# EAGLE design OptocouplerTest (EAGLE 9.6.2)
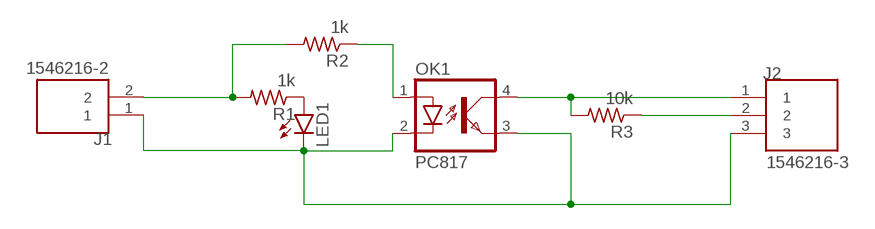
[diagram p0: schematic, sheet 1]

## Parts
J1  1546216-2  [TE_1546216-2]
J2  1546216-3  [TE_1546216-3]
LED1  LED3MM  [LED3MM]
OK1  PC817  [DIL04]
R1  1k  R-US_0207/15  [0207/15]
R2  1k  R-US_0207/15  [0207/15]
R3  10k  R-US_0207/15  [0207/15]

## Nets
N$1: LED1.A R1.1
N$2: J1.2 R1.2 R2.2
N$3: OK1.1(A) R2.1
N$4: J1.1 J2.3 LED1.K(C) OK1.2(C) OK1.3(EMIT)
N$5: J2.2 R3.1
N$6: J2.1 OK1.4(COL) R3.2

## Library data of the parts
J1 = terminal-block-2p:1546216-2: Check availability <https://pricing.snapeda.com/parts/1546216-2/TE%20Connectivity/view-part?ref=eda>; AVAILABILITY: In Stock; CENTERLINE_PITCH: 5 mm[.197 in]; COMMENT: 1546216-2; DESCRIPTION: TERMI-BLOK PCB MOUNT 90 2P.; EU_ROHS_COMPLIANCE: Compliant with Exemptions; MF: TE Connectivity; MP: 1546216-2; NUMBER_OF_POSITIONS: 2; PACKAGE: None; PRICE: None; PURCHASE-URL: https://pricing.snapeda.com/search/part/1546216-2/?ref=eda
J2 = terminal-block-3p:1546216-3: Check availability <https://pricing.snapeda.com/parts/1546216-3/TE%20Connectivity/view-part?ref=eda>; AVAILABILITY: In Stock; COMMENT: 1546216-3; DESCRIPTION: 3 Position Wire to Board Terminal Block Horizontal with Board 0.197 (5.00mm) Through Hole; MF: TE Connectivity; MP: 1546216-3; PACKAGE: None; PRICE: None; PURCHASE-URL: https://pricing.snapeda.com/search/part/1546216-3/?ref=eda
LED1 = led:LED: LED OSRAM: - CHIPLED LG R971, LG N971, LY N971, LG Q971, LY Q971, LO R971, LY R971 LH N974, LH R974 LS Q976, LO Q976, LY Q976 LO Q996 - Hyper CHIPLED LW Q18S LB Q993, LB Q99A, LB R99A - SideLED LS A670, LO A670, LY A670, LG A670, LP A670 LB A673, LV A673, LT A673, LW A673 LH A674 LY A675 LS A676, LA A676, LO A676, LY A676, LW A676 LS A679, LY A679, LG A679 - Hyper Micro SIDELED® LS Y876, LA Y876, LO Y876, LY Y876 LT Y87S - SmartLED LW L88C, LW L88S LB L89C, LB L89S, LG L890 LS L89K, LO L89K, LY L89K LS L896, LA L896, LO L896, LY L896 - TOPLED LS T670, LO T670, LY T670, LG T670, LP T670 LSG T670, LSP T670, LSY T670, LOP T670, LYG T670 LG T671, LOG T671, LSG T671 LB T673, LV T673, LT T673, LW T673 LH T674 LS T676, LA T676, LO T676, LY T676, LB T676, LH T676, LSB T676, LW T676 LB T67C, LV T67C, LT T67C, LS T67K, LO T67K, LY T67K, LW E67C LS E67B, LA E67B, LO E67B, LY E67B, LB E67C, LV E67C, LT E67C LW T67C LS T679, LY T679, LG T679 LS T770, LO T770, LY T770, LG T770, LP T770 LB T773, LV T773, LT T773, LW T773 LH T774 LS E675, LA E675, LY E675, LS T675 LS T776, LA T776, LO T776, LY T776, LB T776 LHGB T686 LT T68C, LB T68C - Hyper Mini TOPLED® LB M676 - Mini TOPLED Santana® LG M470 LS M47K, LO M47K, LY M47K Source: http://www.osram.convergy.de LUXEON: - LUMILED® LXK2-PW12-R00, LXK2-PW12-S00, LXK2-PW14-U00, LXK2-PW14-V00 LXK2-PM12-R00, LXK2-PM12-S00, LXK2-PM14-U00 LXK2-PE12-Q00, LXK2-PE12-R00, LXK2-PE12-S00, LXK2-PE14-T00, LXK2-PE14-U00 LXK2-PB12-K00, LXK2-PB12-L00, LXK2-PB12-M00, LXK2-PB14-N00, LXK2-PB14-P00, LXK2-PB14-Q00 LXK2-PR12-L00, LXK2-PR12-M00, LXK2-PR14-Q00, LXK2-PR14-R00 LXK2-PD12-Q00, LXK2-PD12-R00, LXK2-PD12-S00 LXK2-PH12-R00, LXK2-PH12-S00 LXK2-PL12-P00, LXK2-PL12-Q00, LXK2-PL12-R00 Source: www.luxeon.com KINGBRIGHT: KA-3528ASYC Source: www.kingbright.com
OK1 = optocoupler:PC817: SHARP OPTO COUPLER; MPN: PC817X4J000F; OC_FARNELL: 9707727; OC_NEWARK: 97K7059
R1-R3 = rcl:R-US_: RESISTOR, American symbol; SPICEPREFIX: R

## Board
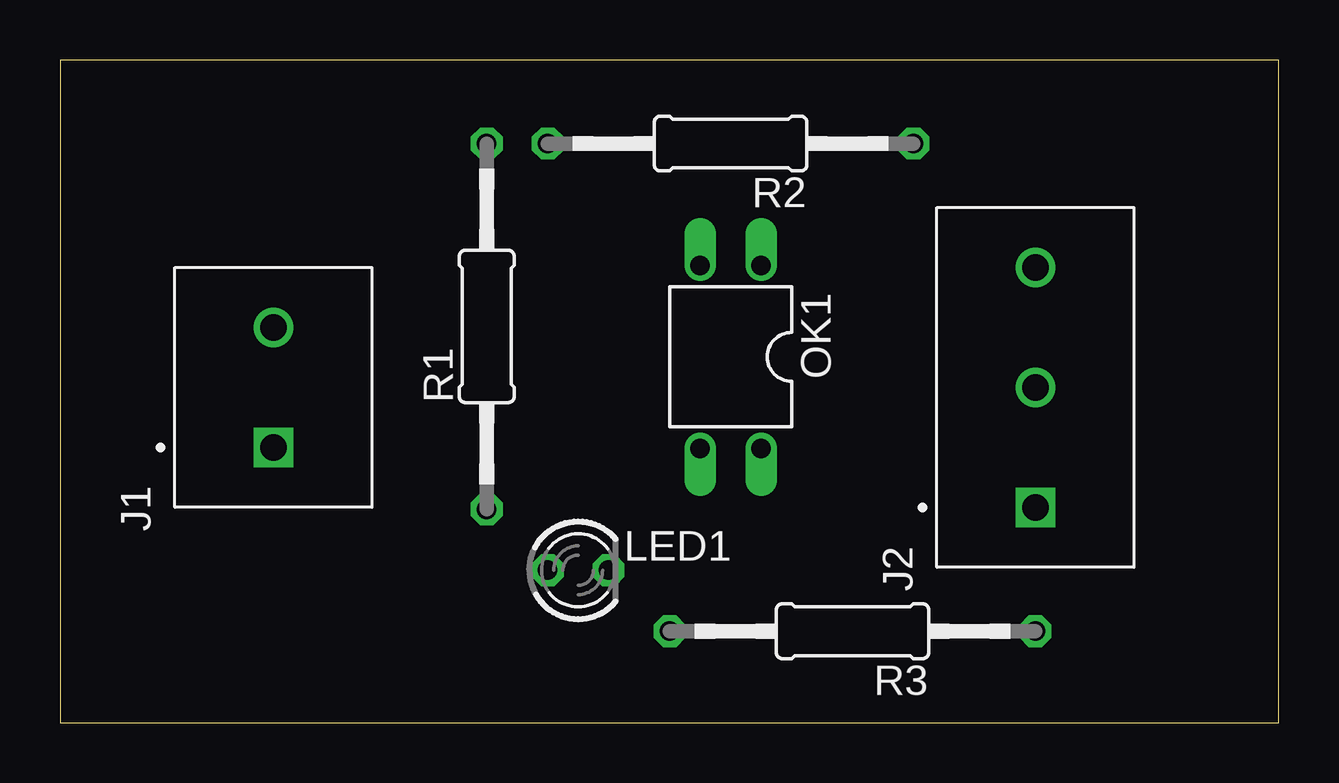
[diagram p1: board, top side]
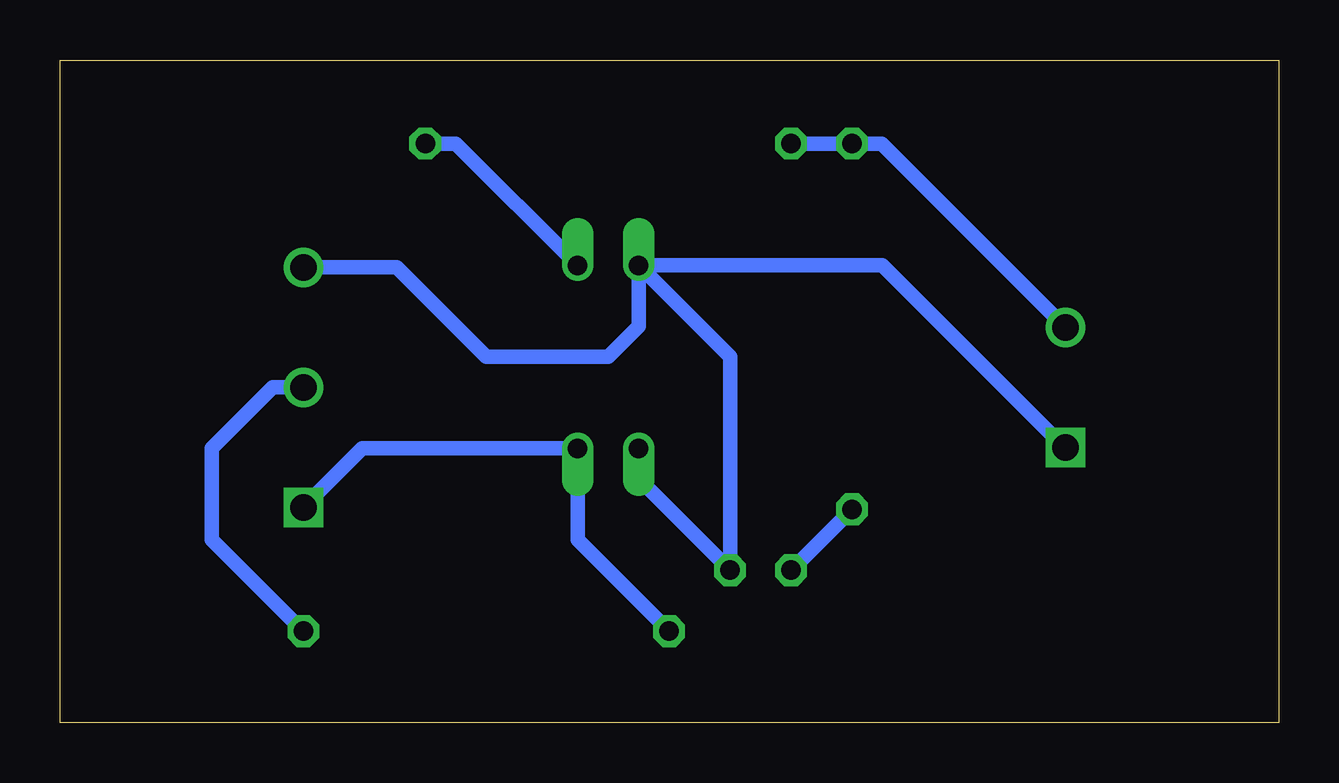
[diagram p2: board, bottom side, seen from below]

Size 50.78 x 27.61 mm. Coordinates in mm from the lower left corner, seen from the top.
Outline: 0,0 50.78,0 50.78,27.61 0,27.61 0,0
Copper layers (1*16): Top 0.035mm / dielectric 1.5mm / Bottom 0.035mm
Design rules "default": minimum track width 6mil, minimum drill 0.35mm, track to track 6mil, track to pad 6mil, pad to pad 6mil, via to via 6mil, smd to smd 6mil, copper to edge 40mil, drill to drill 6mil, minimum pad ring 10mil, minimum via ring 8mil, stop-mask expansion 4mil, vias tented up to drill 0mil, thermal gap 10mil

### Footprints (pad centres in the part's own frame; a part is rotated, then mirrored left to right if it is on the bottom)
TE_1546216-2 = drill 1.1 square: 1 -2.5,0 | drill 1.1: 2 2.5,0
TE_1546216-3 = drill 1.1 square: 1 -5,0 | drill 1.1: 2 0,0; 3 5,0
LED3MM = drill 0.813 octagon: A -1.27,0; K 1.27,0
DIL04 = drill 0.813 offset: 1 -1.27,-3.81; 2 1.27,-3.81; 3 1.27,3.81; 4 -1.27,3.81
0207/15 = drill 0.813 octagon: 1 -7.62,0; 2 7.62,0

### Placement (x,y rotation side)
J1  8.89,13.97 90 top
J2  40.64,13.97 90 top
LED1  21.59,6.35 0 top
OK1  27.94,15.24 180 top
R1  17.78,16.51 90 top
R2  27.94,24.13 180 top
R3  33.02,3.81 180 top

### Tracks (layer width: path | path; a pad name or v marks a point on that pad's centre or on a via)
N$1
  Bottom 0.61: LED1.A R1.1
N$2
  Bottom 0.61: J1.2 16.55,24.13 R1.2 R2.2
N$3
  Bottom 0.61: OK1.1 34.29,24.13 R2.1
N$4
  Bottom 0.61: OK1.2 16.51,19.05 8.93,11.47 J1.1 | OK1.2 22.86,15.24 LED1.K 26.67,10.16 OK1.3 | J2.3 36.75,18.97 33.02,15.24 27.94,15.24 26.67,16.51 OK1.2
N$5
  Bottom 0.61: J2.2 41.91,13.97 44.45,11.43 44.45,7.62 R3.1
N$6
  Bottom 0.61: R3.2 29.21,7.62 OK1.4 38.18,11.43 J2.1